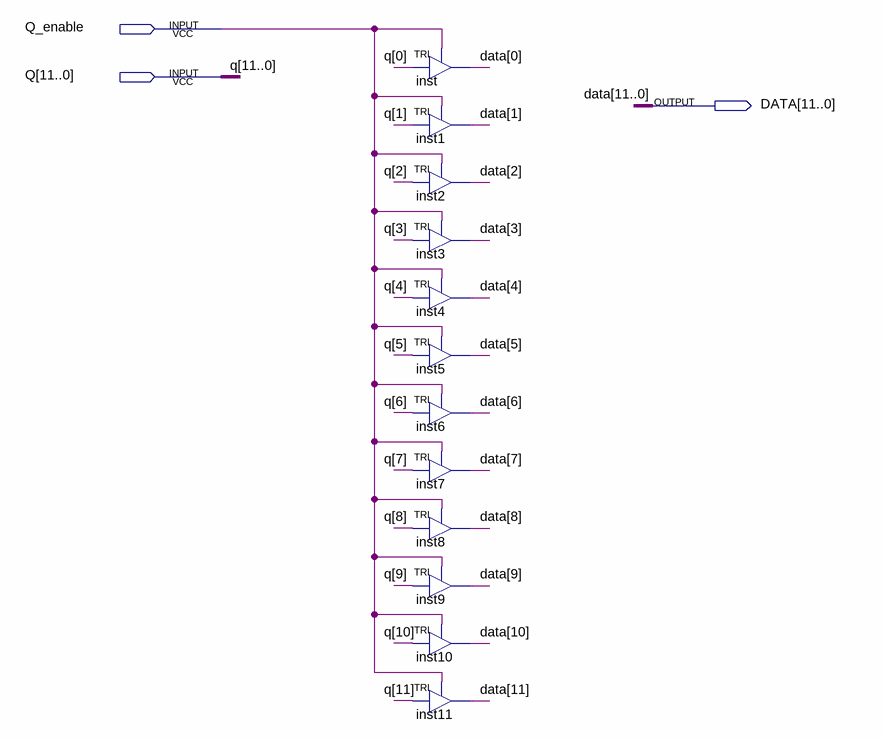
[diagram p0: schematic sheet]
// Quartus schematic tristate_12bits.bdf as structural Verilog: 12 symbols, 3 pins
module tristate_12bits (
  input  Q_enable,
  input  [11:0] Q,
  output [11:0] DATA
);

  TRI inst (.IN(Q[0]), .OE(Q_enable), .OUT(DATA[0]));
  TRI inst1 (.IN(Q[1]), .OE(Q_enable), .OUT(DATA[1]));
  TRI inst2 (.IN(Q[2]), .OE(Q_enable), .OUT(DATA[2]));
  TRI inst3 (.IN(Q[3]), .OE(Q_enable), .OUT(DATA[3]));
  TRI inst4 (.IN(Q[4]), .OE(Q_enable), .OUT(DATA[4]));
  TRI inst5 (.IN(Q[5]), .OE(Q_enable), .OUT(DATA[5]));
  TRI inst6 (.IN(Q[6]), .OE(Q_enable), .OUT(DATA[6]));
  TRI inst7 (.IN(Q[7]), .OE(Q_enable), .OUT(DATA[7]));
  TRI inst8 (.IN(Q[8]), .OE(Q_enable), .OUT(DATA[8]));
  TRI inst9 (.IN(Q[9]), .OE(Q_enable), .OUT(DATA[9]));
  TRI inst10 (.IN(Q[10]), .OE(Q_enable), .OUT(DATA[10]));
  TRI inst11 (.IN(Q[11]), .OE(Q_enable), .OUT(DATA[11]));
endmodule
